# Altium schematic sheet solar_cell.SchDoc
size A; SheetNumber: 8; SheetTotal: 8
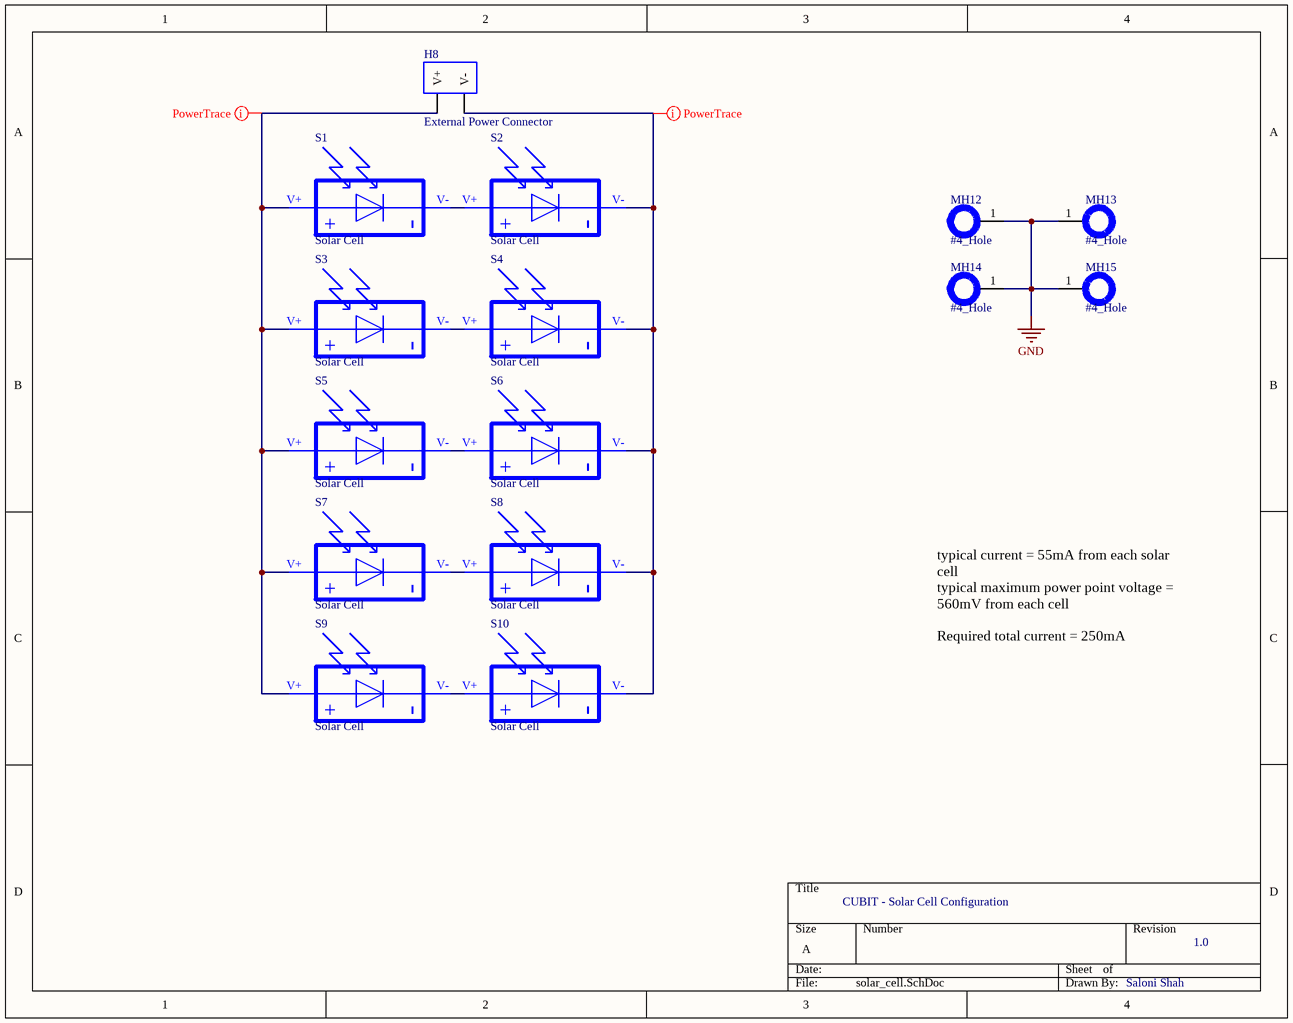
[diagram p0: solar_cell.SchDoc]

## Parts
H8  External Power Connector  [2_PIN_100mil]
MH12  #4_Hole  [HOLE_#4]
MH13  #4_Hole  [HOLE_#4]
MH14  #4_Hole  [HOLE_#4]
MH15  #4_Hole  [HOLE_#4]
S1  Solar Cell  [KXOB25-14X1F]
S2  Solar Cell  [KXOB25-14X1F]
S3  Solar Cell  [KXOB25-14X1F]
S4  Solar Cell  [KXOB25-14X1F]
S5  Solar Cell  [KXOB25-14X1F]
S6  Solar Cell  [KXOB25-14X1F]
S7  Solar Cell  [KXOB25-14X1F]
S8  Solar Cell  [KXOB25-14X1F]
S9  Solar Cell  [KXOB25-14X1F]
S10  Solar Cell  [KXOB25-14X1F]

## Nets
GND: MH12.1 MH13.1 MH14.1 MH15.1
NetH8_1: H8.1(V+) S1.V+ S3.V+ S5.V+ S7.V+ S9.V+
NetH8_2: H8.2(V-) S2.V- S4.V- S6.V- S8.V- S10.V-
NetS1_V-: S1.V- S2.V+
NetS3_V-: S3.V- S4.V+
NetS5_V-: S5.V- S6.V+
NetS7_V-: S7.V- S8.V+
NetS9_V-: S9.V- S10.V+

## Layout directives
rule Width Constraint [Pref Width = 20mil    Min Width = 20mil    Max Width = 100mil]: NetH8_1, NetH8_2

## Notes on the sheet
- typical current = 55mA from each solar cell
  typical maximum power point voltage = 560mV from each cell
  Required total current = 250mA
- CUBIT - Solar Cell Configuration
- 1.0
- Saloni Shah
- (in symbol KXOB25-14X1F) +; -

## Library data of the parts
H8 = ext_pwr_conn
MH12-MH15 = Mechanical_Hole
S1-S10 = KXOB25-14X1F: MONOCRYS SOLAR CELL 30.7MW 690MV; MF: ANYSOLAR Ltd; Price: None; MP: KXOB25-14X1F; Availability: Bad; SnapEDA_Link: https://www.snapeda.com/parts/KXOB25-14X1F/Sola/view-part/5163586/?ref=snap; Value: *; Package: None; Check_prices: https://www.snapeda.com/parts/KXOB25-14X1F/Sola/view-part/5163586/?ref=eda